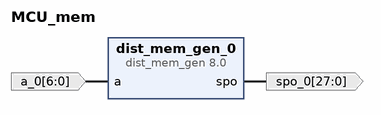
[diagram p0: block diagram of the top level]
# Vivado block design MCU_mem, xc7a100tcsg324-1, Vivado 2018.2
create_bd_design MCU_mem

create_bd_port -dir I -from 6 -to 0 a_0
create_bd_port -dir O -from 27 -to 0 spo_0

create_bd_cell -type ip -vlnv xilinx.com:ip:dist_mem_gen:8.0 dist_mem_gen_0
set_property -dict [list \
  CONFIG.depth 128 \
  CONFIG.data_width 28 \
  CONFIG.memory_type rom \
  CONFIG.coefficient_file ../../../../../../mem1.coe \
] [get_bd_cells dist_mem_gen_0]

# ---- connections ----

connect_bd_net -net a_0_1 [get_bd_ports a_0] [get_bd_pins dist_mem_gen_0/a]
connect_bd_net [get_bd_pins dist_mem_gen_0/spo] [get_bd_ports spo_0]

validate_bd_design
save_bd_design
